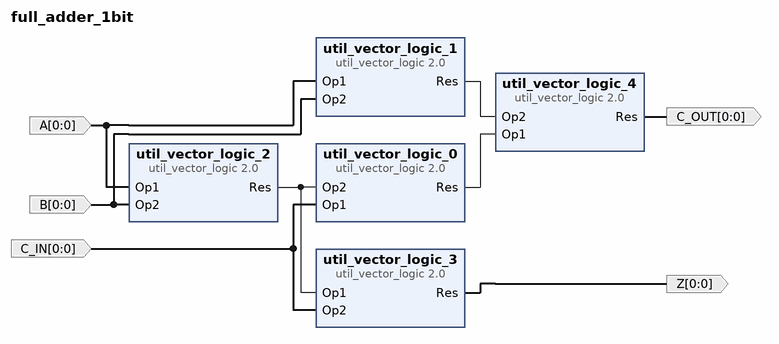
[diagram p0: block diagram of the top level]
# Vivado block design full_adder_1bit, xc7a100tcsg324-1, Vivado 2020.2
create_bd_design full_adder_1bit

create_bd_port -dir O -from 0 -to 0 C_OUT
create_bd_port -dir I -from 0 -to 0 A
create_bd_port -dir I -from 0 -to 0 B
create_bd_port -dir I -from 0 -to 0 C_IN
create_bd_port -dir O -from 0 -to 0 Z

create_bd_cell -type ip -vlnv xilinx.com:ip:util_vector_logic:2.0 util_vector_logic_0
set_property -dict {CONFIG.C_SIZE 1} [get_bd_cells util_vector_logic_0]
create_bd_cell -type ip -vlnv xilinx.com:ip:util_vector_logic:2.0 util_vector_logic_1
set_property -dict {CONFIG.C_SIZE 1} [get_bd_cells util_vector_logic_1]
create_bd_cell -type ip -vlnv xilinx.com:ip:util_vector_logic:2.0 util_vector_logic_2
set_property -dict {CONFIG.C_OPERATION xor CONFIG.C_SIZE 1} [get_bd_cells util_vector_logic_2]
create_bd_cell -type ip -vlnv xilinx.com:ip:util_vector_logic:2.0 util_vector_logic_3
set_property -dict {CONFIG.C_OPERATION xor CONFIG.C_SIZE 1} [get_bd_cells util_vector_logic_3]
create_bd_cell -type ip -vlnv xilinx.com:ip:util_vector_logic:2.0 util_vector_logic_4
set_property -dict {CONFIG.C_OPERATION or CONFIG.C_SIZE 1} [get_bd_cells util_vector_logic_4]

# ---- connections ----

connect_bd_net [get_bd_pins util_vector_logic_4/Res] [get_bd_ports C_OUT]
connect_bd_net [get_bd_pins util_vector_logic_0/Res] [get_bd_pins util_vector_logic_4/Op1]
connect_bd_net [get_bd_pins util_vector_logic_1/Res] [get_bd_pins util_vector_logic_4/Op2]
connect_bd_net -net Op1_0_1 [get_bd_ports A] [get_bd_pins util_vector_logic_2/Op1] [get_bd_pins util_vector_logic_1/Op1]
connect_bd_net -net Op2_0_1 [get_bd_ports B] [get_bd_pins util_vector_logic_2/Op2] [get_bd_pins util_vector_logic_1/Op2]
connect_bd_net -net Op2_1_1 [get_bd_ports C_IN] [get_bd_pins util_vector_logic_3/Op2] [get_bd_pins util_vector_logic_0/Op1]
connect_bd_net [get_bd_pins util_vector_logic_3/Res] [get_bd_ports Z]
connect_bd_net [get_bd_pins util_vector_logic_2/Res] [get_bd_pins util_vector_logic_3/Op1] [get_bd_pins util_vector_logic_0/Op2]

validate_bd_design
save_bd_design
